# EAGLE design 5V-3.3V Regulators (Pre-prototype V2) (EAGLE 7.6.0)
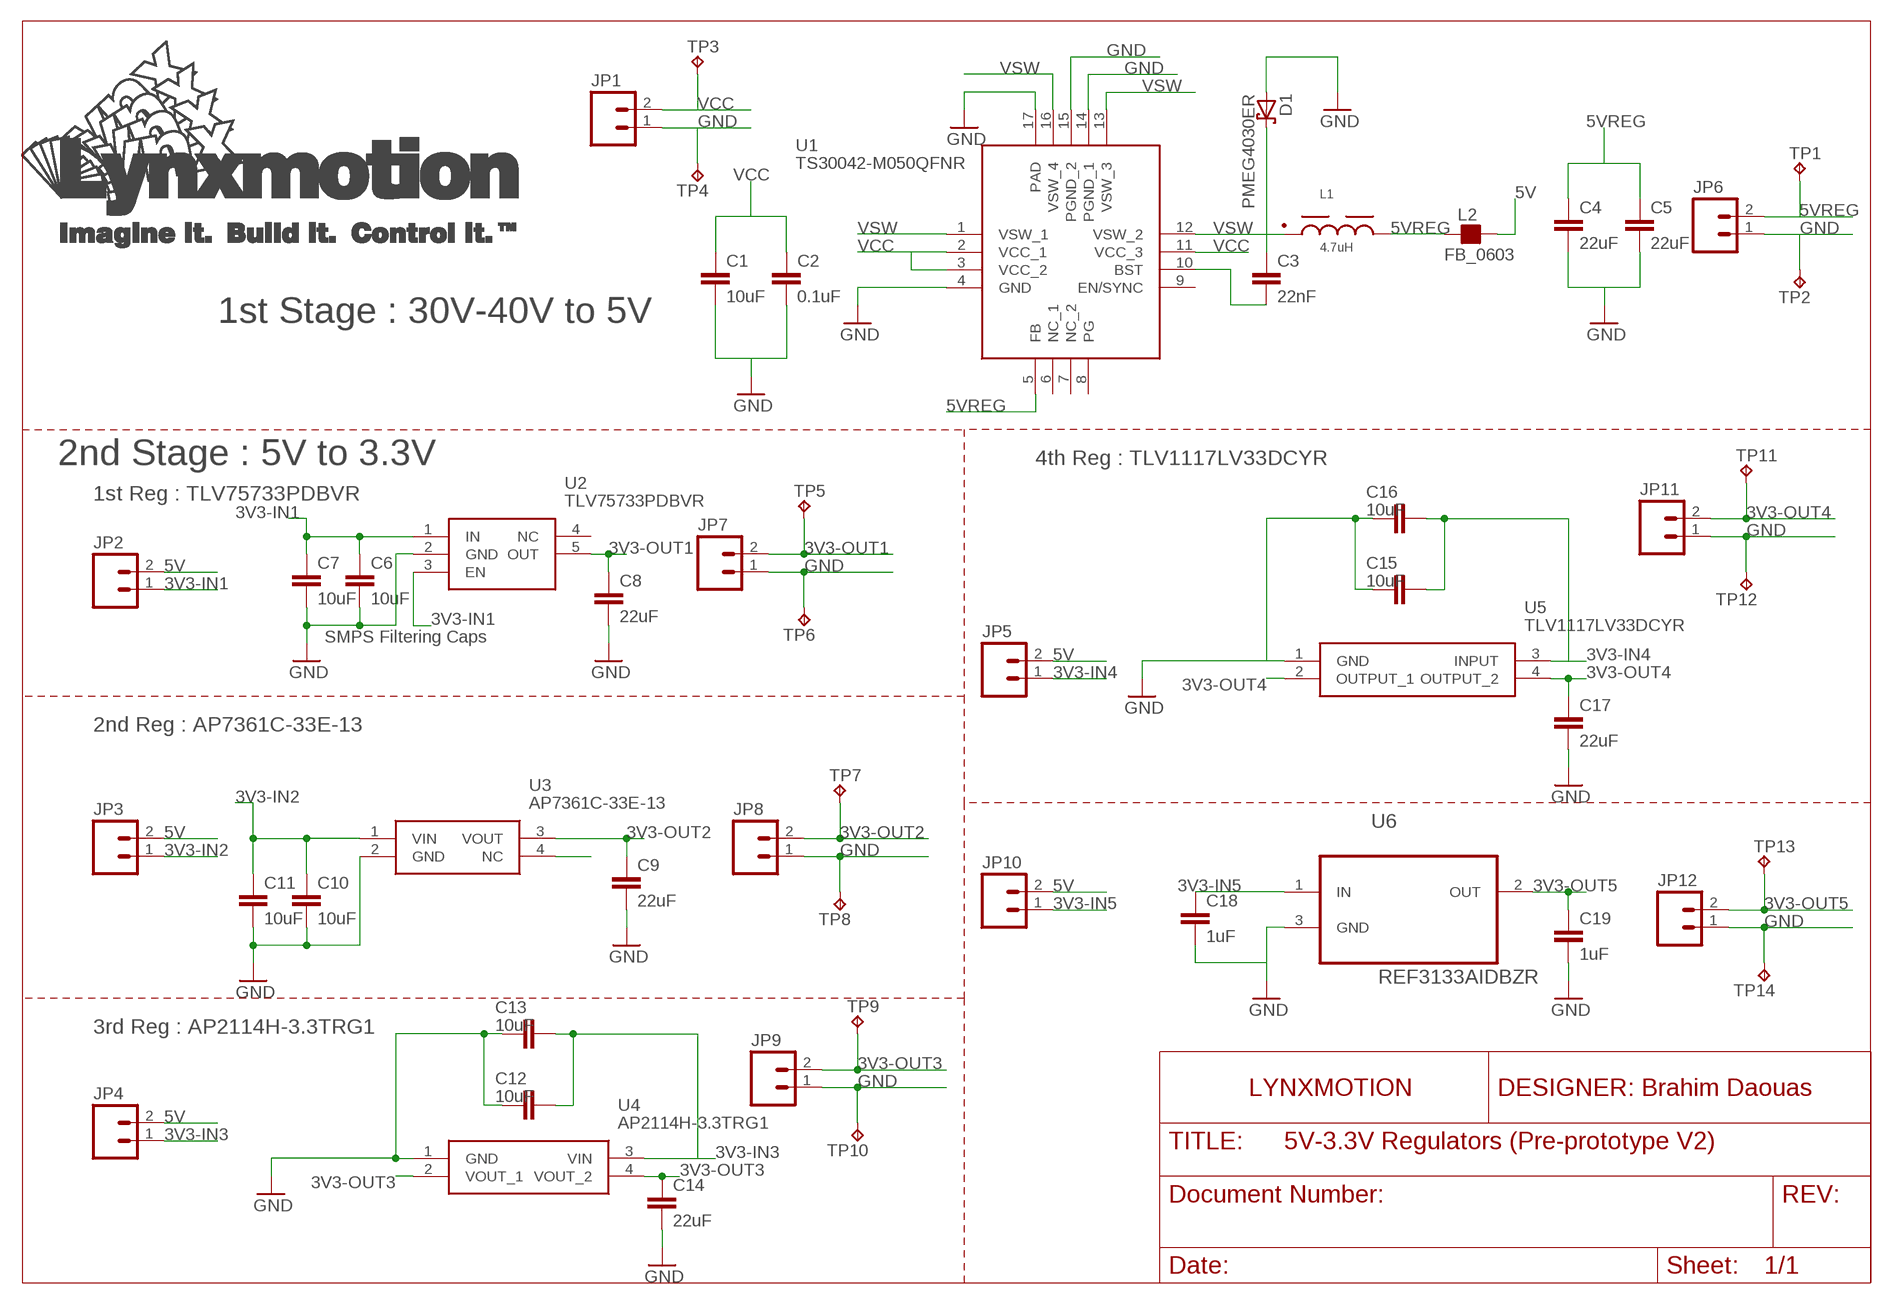
[diagram p0: schematic, sheet 1]

## Parts
C1  10uF  CAP1206  [1206]
C2  0.1uF  CAP0603-CAP  [0603-CAP]
C3  22nF  CAP0402-CAP  [0402-CAP]
C4  22uF  CAP0805  [0805]
C5  22uF  CAP0805  [0805]
C6  10uF  CAP0805  [0805]
C7  10uF  CAP0805  [0805]
C8  22uF  CAP0805  [0805]
C9  22uF  CAP0805  [0805]
C10  10uF  CAP0805  [0805]
C11  10uF  CAP0805  [0805]
C12  10uF  CAP0805  [0805]
C13  10uF  CAP0805  [0805]
C14  22uF  CAP0805  [0805]
C15  10uF  CAP0805  [0805]
C16  10uF  CAP0805  [0805]
C17  22uF  CAP0805  [0805]
C18  1uF  CAP0805  [0805]
C19  1uF  CAP0805  [0805]
D1  PMEG4030ER  [SOD123W]
JP1  M02PTH  [1X02]
JP2  M02PTH  [1X02]
JP3  M02PTH  [1X02]
JP4  M02PTH  [1X02]
JP5  M02PTH  [1X02]
JP6  M02PTH  [1X02]
JP7  M02PTH  [1X02]
JP8  M02PTH  [1X02]
JP9  M02PTH  [1X02]
JP10  M02PTH  [1X02]
JP11  M02PTH  [1X02]
JP12  M02PTH  [1X02]
L1  4.7uH  WE-PD2_5848_744774047  [WE-PD2_5848/5820]
L2  FB_0603  [L0603]
TP1  TP-040  [TP-040]
TP2  TP-040  [TP-040]
TP3  TP-040  [TP-040]
TP4  TP-040  [TP-040]
TP5  TP-040  [TP-040]
TP6  TP-040  [TP-040]
TP7  TP-040  [TP-040]
TP8  TP-040  [TP-040]
TP9  TP-040  [TP-040]
TP10  TP-040  [TP-040]
TP11  TP-040  [TP-040]
TP12  TP-040  [TP-040]
TP13  TP-040  [TP-040]
TP14  TP-040  [TP-040]
U1  TS30042-M050QFNR  [QFN16]
U2  TLV75733PDBVR  [SOT95P280X145-5N]
U3  AP7361C-33E-13  [SOT230P700X165-4N]
U4  AP2114H-3.3TRG1  [SOT230P700X180-4N]
U5  TLV1117LV33DCYR  [SOT230P700X180-4N]
U6  REF3133AIDBZR  [SOT95P237X112-3N]

## Nets
3V3-IN1: C6.1 C7.1 JP2.1 U2.1(IN) U2.3(EN)
3V3-IN2: C10.1 C11.1 JP3.1 U3.1(VIN)
3V3-IN3: C12.1 C13.1 JP4.1 U4.3(VIN)
3V3-IN4: C15.1 C16.1 JP5.1 U5.3(INPUT)
3V3-IN5: C18.1 JP10.1 U6.1(IN)
3V3-OUT1: C8.1 JP7.2 TP5.1 U2.5(OUT)
3V3-OUT2: C9.1 JP8.2 TP7.1 U3.3(VOUT)
3V3-OUT3: C14.1 JP9.2 TP9.1 U4.2(VOUT_1) U4.4(VOUT_2)
3V3-OUT4: C17.1 JP11.2 TP11.1 U5.2(OUTPUT_1) U5.4(OUTPUT_2)
3V3-OUT5: C19.1 JP12.2 TP13.1 U6.2(OUT)
5V: JP2.2 JP3.2 JP4.2 JP5.2 JP10.2 L2.2
5VREG: C4.1 C5.1 JP6.2 L1.2 L2.1 TP1.1 U1.5(FB)
GND: C1.2 C2.2 C4.2 C5.2 C6.2 C7.2 C8.2 C9.2 C10.2 C11.2 C12.2 C13.2 C14.2 C15.2 C16.2 C17.2 C18.2 C19.2 D1.2(A) JP1.1 JP6.1 JP7.1 JP8.1 JP9.1 JP11.1 JP12.1 TP2.1 TP4.1 TP6.1 TP8.1 TP10.1 TP12.1 TP14.1 U1.4(GND) U1.14(PGND_1) U1.15(PGND_2) U1.17(PAD) U2.2(GND) U3.2(GND) U4.1(GND) U5.1(GND) U6.3(GND)
N$4: U3.4(NC)
N$105: C3.2 U1.10(BST)
VCC: C1.1 C2.1 JP1.2 TP3.1 U1.2(VCC_1) U1.3(VCC_2) U1.11(VCC_3)
VSW: C3.1 D1.1(K) L1.1 U1.1(VSW_1) U1.12(VSW_2) U1.13(VSW_3) U1.16(VSW_4)
Unconnected: U1.6(NC_1) U1.7(NC_2) U1.8(PG) U1.9(EN/SYNC) U2.4(NC)

## Notes on the sheet
- 1st Stage : 30V-40V to 5V
- 2nd Stage : 5V to 3.3V | 4th Reg : TLV1117LV33DCYR
- 1st Reg : TLV75733PDBVR
- SMPS Filtering Caps
- 2nd Reg : AP7361C-33E-13
- 3rd Reg : AP2114H-3.3TRG1

## Library data of the parts
C1-C19 = SparkFun-Capacitors:CAP: Capacitor Standard 0603 ceramic capacitor, and 0.1" leaded capacitor.
D1 = nxp_60_1_1:PMEG4030E: 40 V, 3 A low VF MEGA Schottky barrier rectifier Planar Maximum Efficiency General Application (MEGA) Schottky barrier rectifier with an integrated guard ring for stress protection. AAL Eindhoven MK
JP1-JP12 = SparkFun-Connectors:M02: Standard 2-pin 0.1" header. Use with - straight break away headers ( PRT-00116) - right angle break away headers (PRT-00553) - swiss pins (PRT-00743) - machine pins (PRT-00117) - female headers (PRT-00115) Molex polarized connector foot print use with: PRT-08233 with associated crimp pins and housings. 2.54_SCREWTERM for use with PRT-10571. 3.5mm Screw Terminal footprints for PRT-08084 5mm Screw Terminal footprints for use with PRT-08432
L1 = EMCComponents (rev19b):WE-PD2_5848: SMD Power Inductor Characteristics Open size Saturation currents up to 14 A Low tolerances at high inductance values Operating temperature: –40 °C to +125 °C Applications Integrated DC/DC-converter Switching regulators with low operating voltages (Graphic cards, embedded PC-Cards, Mainboards) Optimal attenuation in MHz frequency range <http://katalog.we-online.de/media/images/v2/Family_WE-PD2.jpg> Details see: http://katalog.we-online.de/en/pbs/WE-PD2 Updated by Dan Xu 2014-07-08 2014 (C) Wurth Elektronik; WE-NUMBER: 744774047/4,7uH
L2 = rc-master-smd:FB_: FERRITE BEAD
TP1-TP14 = Test Points:TP: TEST POINT PCB Vertical Mount
U1 = LSS_Pro:TS30042-M050QFNR
U2 = TLV75733PDBVR:TLV75733PDBVR: LDO Voltage Regulators 1A Low-IQ Small-Size Low-Dropout (LDO) Regulator 5-SOT-23 -40 to 125 Source: Datasheet <http://www.ti.com/lit/gpn/TLV757P>; DESCRIPTION: LDO Voltage Regulators 1A Low-IQ Small-Size Low-Dropout (LDO) Regulator 5-SOT-23 -40 to 125; HEIGHT: 1.45mm; MANUFACTURER_NAME: Texas Instruments; MANUFACTURER_PART_NUMBER: TLV75733PDBVR; TEXAS_INSTRUMENTS_PART_NUMBER: TLV75733PDBVR; TEXAS_INSTRUMENTS_PRICE-STOCK: https://www.ti.com/store/ti/en/p/product/?p=TLV75733PDBVR
U3 = AP7361C-33E-13:AP7361C-33E-13: 1A LOW DROPOUT ADJUSTABLE AND FIXED-MODE REGULATOR WITH ENABLE Source: Datasheet <https://www.diodes.com/assets/Datasheets/AP7361C.pdf>; DESCRIPTION: 1A LOW DROPOUT ADJUSTABLE AND FIXED-MODE REGULATOR WITH ENABLE; HEIGHT: 1.65mm; MANUFACTURER_NAME: Diodes Inc.; MANUFACTURER_PART_NUMBER: AP7361C-33E-13
U4 = AP2114H-3.3TRG1:AP2114H-3.3TRG1: 1A 3.3V Low Noise LDO Regulator SOT223 DiodesZetex AP2114H-3.3TRG1, LDO Voltage Regulator, 1 (Min)A, 3.3 V +/-1.5%, 2.5 6 Vin, 3-Pin SOT-223 Source: Datasheet <http://uk.rs-online.com/web/p/products/8283528>; ALLIED_NUMBER: 70550988; ALLIED_PRICE-STOCK: https://www.alliedelec.com/diodes-inc-ap2114h-3-3trg1/70550988/; DESCRIPTION: 1A 3.3V Low Noise LDO Regulator SOT223 DiodesZetex AP2114H-3.3TRG1, LDO Voltage Regulator, 1 (Min)A, 3.3 V +/-1.5%, 2.5 6 Vin, 3-Pin SOT-223; HEIGHT: 1.8mm; MANUFACTURER_NAME: Diodes Inc.; MANUFACTURER_PART_NUMBER: AP2114H-3.3TRG1; MOUSER_PART_NUMBER: 621-AP2114H-3.3TRG1; MOUSER_PRICE-STOCK: https://www.mouser.com/Search/Refine.aspx?Keyword=621-AP2114H-3.3TRG1; RS_PART_NUMBER: 8283528; RS_PRICE-STOCK: https://uk.rs-online.com/web/p/products/8283528
U5 = TLV1117LV33DCYR:TLV1117LV33DCYR: 1-A, Positive Fixed Voltage, Low-Dropout Regulator Source: Datasheet <http://www.ti.com/lit/gpn/tlv1117lv>; DESCRIPTION: 1-A, Positive Fixed Voltage, Low-Dropout Regulator; HEIGHT: 1.8mm; MANUFACTURER_NAME: Texas Instruments; MANUFACTURER_PART_NUMBER: TLV1117LV33DCYR; MOUSER_PART_NUMBER: 595-TLV1117LV33DCYR; MOUSER_PRICE-STOCK: https://www.mouser.com/Search/Refine.aspx?Keyword=595-TLV1117LV33DCYR
U6 = REF3133AIDBZR:REF3133AIDBZR: SERIES VOLTAGE REFERENCE; AVAILABILITY: Unavailable; DESCRIPTION: 20ppm/°C Max, 100µA, SOT23-3 Series Voltage Reference 3-SOT-23 -40 to 125; MF: Texas Instruments; MP: REF3133AIDBZR; PACKAGE: SOT-23-3 Texas Instruments; PRICE: None

## Board
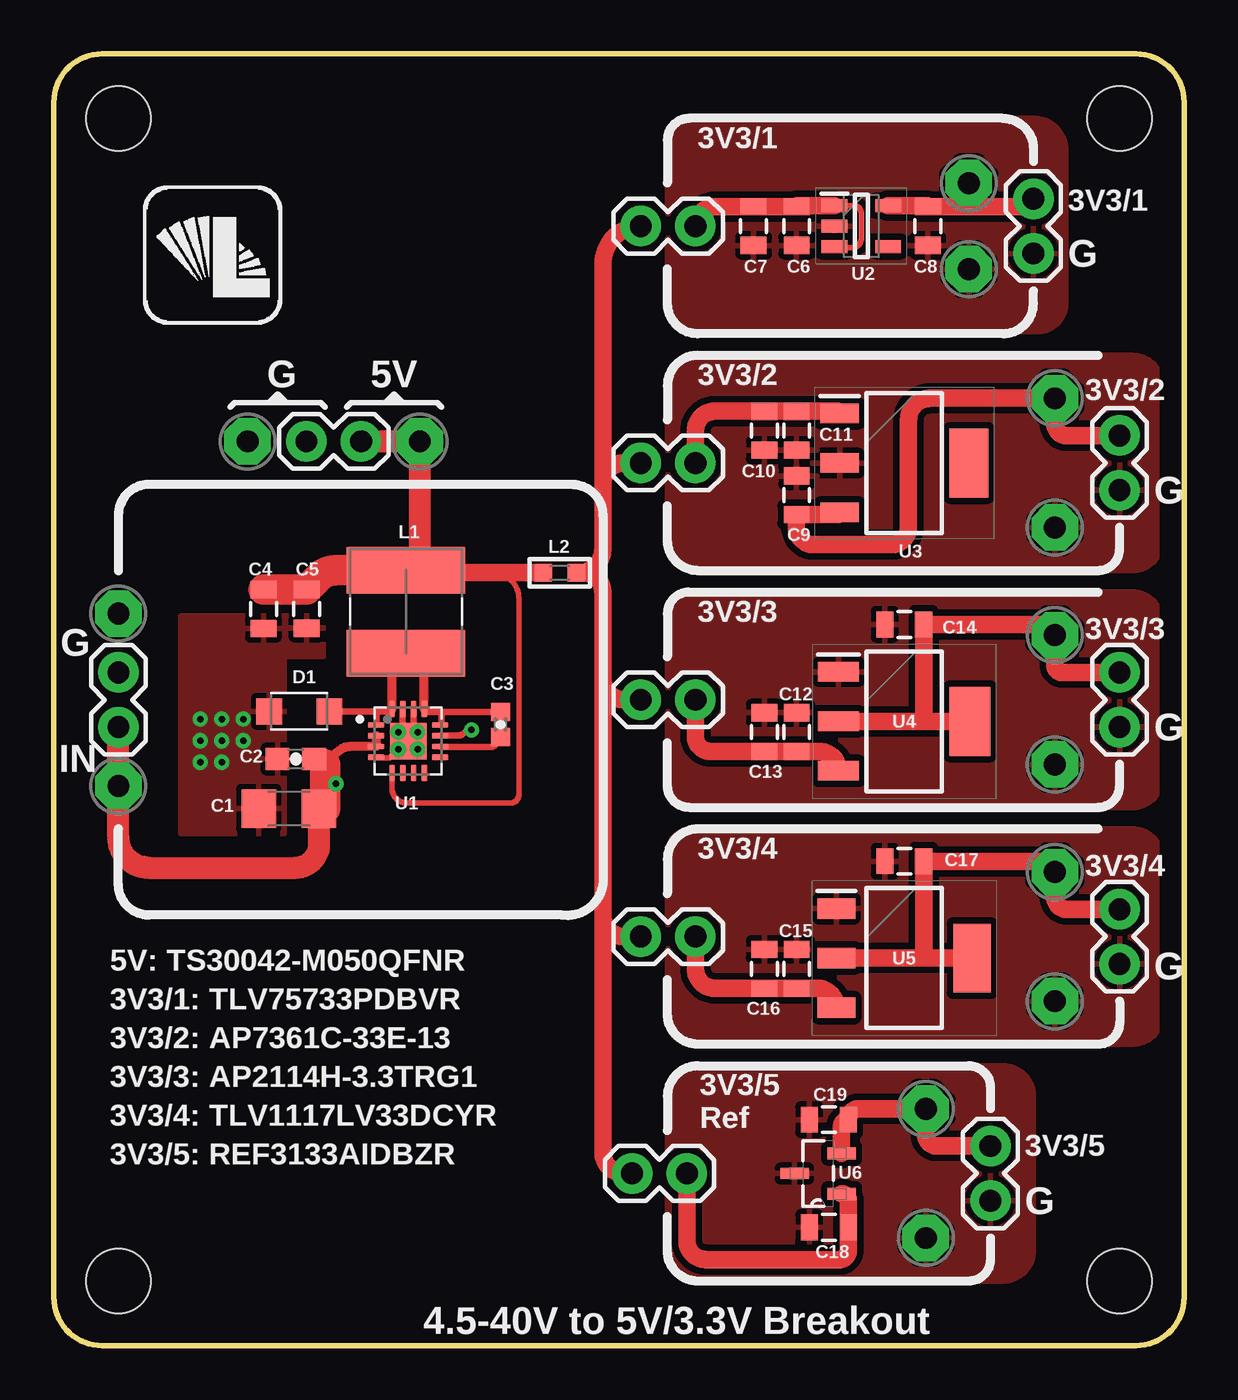
[diagram p1: board, top side]
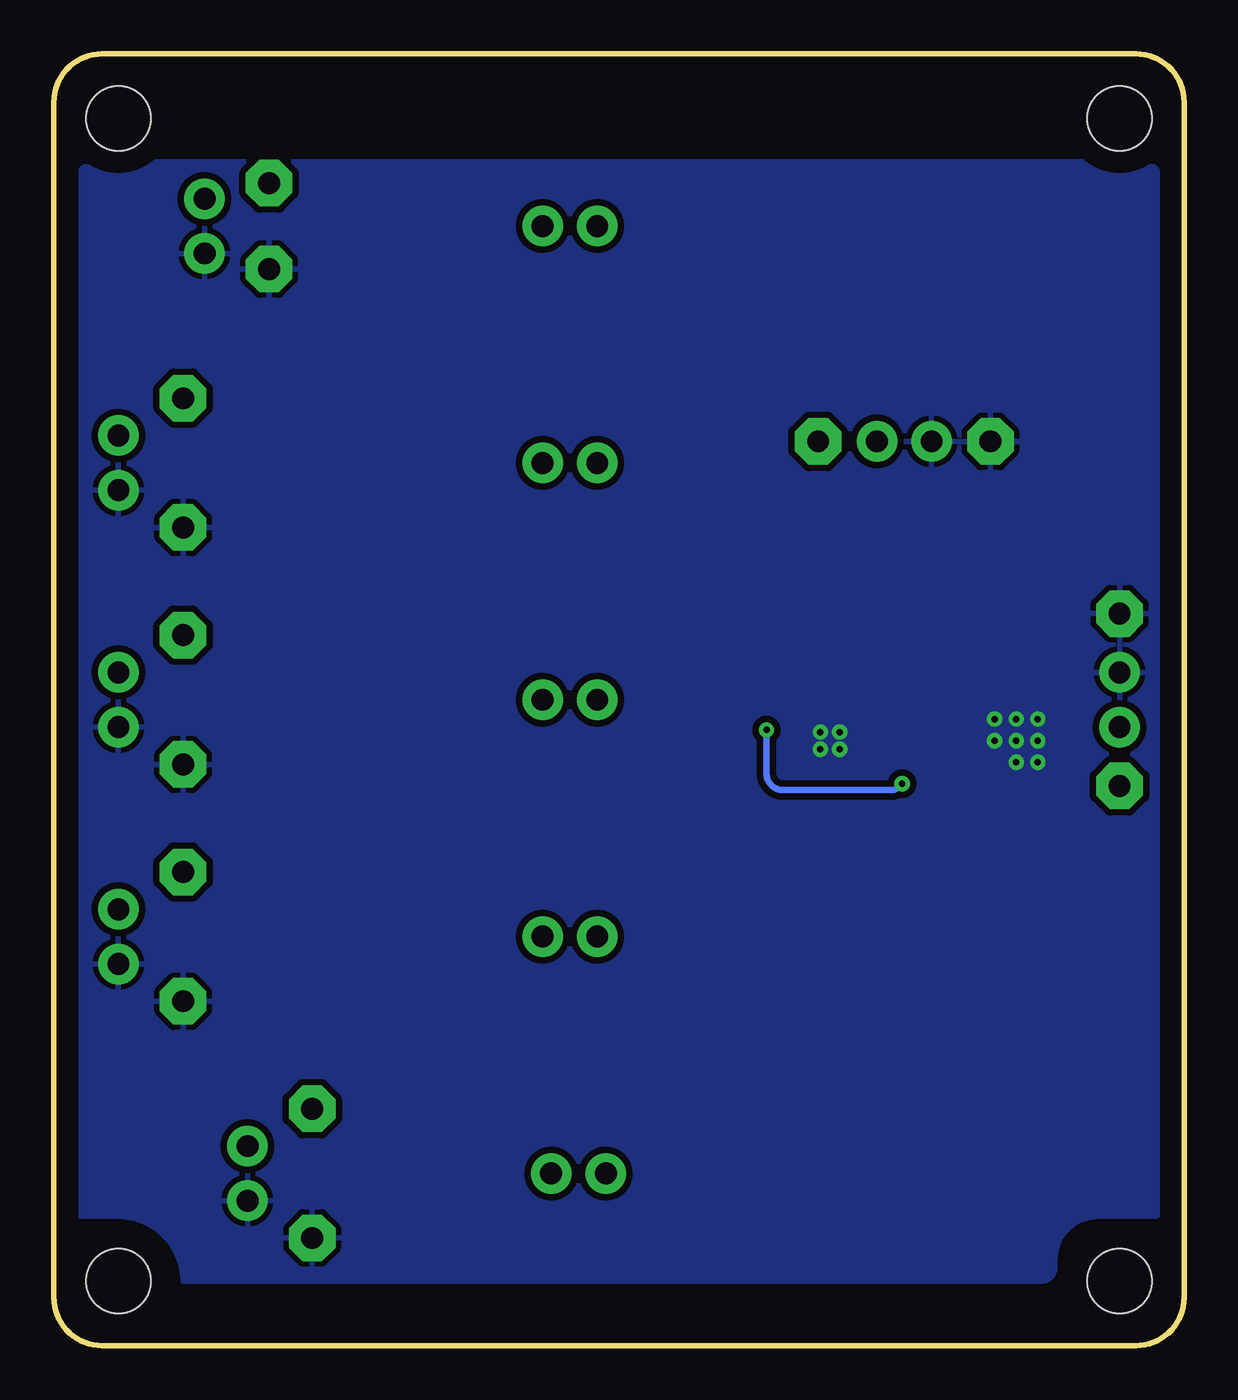
[diagram p2: board, bottom side, seen from below]

Size 52.5 x 60 mm. Coordinates in mm from the lower left corner, seen from the top.
Outline: 2.24,0 50.26,0 arc90 52.5,2.24 52.5,57.76 arc90 50.26,60 2.24,60 arc90 0,57.76 0,2.24 arc90 2.24,0
Copper layers (1*16): Top 0.035mm / dielectric 1.5mm / Bottom 0.035mm
Design rules "default *": minimum track width 10mil, minimum drill 0.3mm, track to track 8mil, track to pad 8mil, pad to pad 8mil, via to via 8mil, smd to smd 8mil, copper to edge 40mil, drill to drill 8mil, minimum pad ring 10mil, minimum via ring 8mil, stop-mask expansion 4mil, vias tented up to drill 25mil, thermal gap 10mil
Holes 3 mm at 3,57 49.5,57 3,3 49.5,3

### Footprints (pad centres in the part's own frame; a part is rotated, then mirrored left to right if it is on the bottom)
1206 = smd 1.6 x 1.8: 1 -1.4,0; 2 1.4,0
0603-CAP = smd 1.1 x 1: 1 -0.85,0; 2 0.85,0
0402-CAP = smd 0.85 x 0.9: 1 -0.58,0; 2 0.58,0
0805 = smd 0.8 x 1.2: 1 -0.9,0; 2 0.9,0
SOD123W = smd 1.2 x 1.2: 1 -1.4,0; 2 1.4,0
1X02 = drill 1.016 pad 1.88: 1 0,0; 2 2.54,0
WE-PD2_5848/5820 = smd 2.15 x 5.5: 1 -1.925,0; 2 1.925,0
L0603 = smd 0.8 x 0.8: 1 -0.762,0; 2 0.762,0
TP-040 = drill 1.016 pad 2.159 octagon: 1 0,0
QFN16 = smd 0.76 x 0.26: 1 -1.485,0.75; 2 -1.485,0.25; 3 -1.485,-0.25; 4 -1.485,-0.75; 9 1.485,-0.75; 10 1.485,-0.25; 11 1.485,0.25; 12 1.485,0.75 | smd 0.26 x 0.76: 5 -0.75,-1.485; 6 -0.25,-1.485; 7 0.25,-1.485; 8 0.75,-1.485; 13 0.75,1.485; 14 0.25,1.485; 15 -0.25,1.485; 16 -0.75,1.485 | smd 1.7 x 1.7: 17 0,0
SOT95P280X145-5N = smd 1.2 x 0.6: 1 -1.25,0.95; 2 -1.25,0; 3 -1.25,-0.95; 4 1.25,-0.95; 5 1.25,0.95
SOT230P700X165-4N = smd 1.8 x 0.9: 1 -3,2.3; 2 -3,0; 3 -3,-2.3 | smd 1.8 x 3.2: 4 3,0
SOT230P700X180-4N = smd 1.9 x 0.9: 1 -3.05,2.3; 2 -3.05,0; 3 -3.05,-2.3 | smd 1.9 x 3.2: 4 3.05,0
SOT230P700X180-4N' = smd 1.75 x 0.95: 1 -3.15,2.3; 2 -3.15,0; 3 -3.15,-2.3 | smd 1.75 x 3.2: 4 3.15,0
SOT95P237X112-3N = smd 1.321 x 0.559: 1 -1.092,0.94; 2 -1.092,-0.94 | smd 1.321 x 0.508: 3 1.092,0

### Placement (x,y rotation side)
C1  10.92,24.94 180 top
C2  11.24,27.25 180 top
C3  20.75,28.85 270 top
C4  9.74,34.21 270 top
C5  11.74,34.22 270 top
C6  34.5,52 270 top
C7  32.5,52 270 top
C8  40.6,52 270 top
C9  34.5,39.5 90 top
C10  33,42.5 270 top
C11  34.5,42.5 270 top
C12  34.5,28.5 90 top
C13  33,28.5 90 top
C14  39.5,33.5 180 top
C15  34.5,17.5 90 top
C16  33,17.5 90 top
C17  39.5,22.5 180 top
C18  36,5.5 180 top
C19  36,10.5 180 top
D1  11.4,29.46 180 top
JP1  3,31.27 270 top
JP2  29.8,52 180 top
JP3  29.8,41 180 top
JP4  29.8,30 180 top
JP5  29.8,19 180 top
JP6  11.73,42 0 top
JP7  45.5,50.73 90 top
JP8  49.5,39.73 90 top
JP9  49.5,28.73 90 top
JP10  29.4,8 180 top
JP11  49.5,17.73 90 top
JP12  43.5,6.73 90 top
L1  16.36,34.09 90 top
L2  23.5,35.9 0 top
TP1  17,42 0 top
TP2  9,42 0 top
TP3  3,26 0 top
TP4  3,34 0 top
TP5  42.5,54 0 top
TP6  42.5,50 0 top
TP7  46.5,44 0 top
TP8  46.5,38 0 top
TP9  46.5,33 0 top
TP10  46.5,27 0 top
TP11  46.5,22 0 top
TP12  46.5,16 0 top
TP13  40.5,11 0 top
TP14  40.5,5 0 top
U1  16.46,28.08 0 top
U2  37.5,52 0 top
U3  39.5,41 0 top
U4  39.5,29 0 top
U5  TLV1117LV33DCYR  [SOT230P700X180-4N']  39.5,18 0 top
U6  35.5,8 180 top

### Tracks (layer width: path | path; a pad name or v marks a point on that pad's centre or on a via)
3V3-IN1
  Top 0.254: U2.1 37.15,52.95 arc-90 37.5,52.6 37.5,51.4 arc-90 37.1,51 36.3,51 arc-90 U2.3
  Top 0.813: U2.1 34.55,52.95 arc90 C6.1 C7.1 30.7,52.9 arc90 JP2.1
3V3-IN2
  Top 0.813: JP3.1 29.8,42.5 arc-90 30.7,43.4 C10.1 C11.1 36.4,43.4 arc-90 U3.1
3V3-IN3
  Top 0.813: JP4.1 29.8,28.3 arc90 30.5,27.6 C13.1 C12.1 35.55,27.6 arc-90 U4.3
3V3-IN4
  Top 0.813: JP5.1 29.8,17.5 arc90 30.7,16.6 C16.1 C15.1 35.45,16.6 arc-90 U5.3
3V3-IN5
  Top 0.813: JP10.1 29.4,4.9 arc90 30.3,4 36.5,4 arc90 36.9,4.4 C18.1 36.9,6.75 arc90 U6.1
3V3-OUT1
  Top 0.813: U2.5 40.55,52.95 arc-90 C8.1 41.5,52.9 | 41.5,52.9 45.13,52.9 arc90 JP7.2 | TP5.1 42.5,53.9 arc-90 41.5,52.9
3V3-OUT2
  Top 0.813: U3.3 arc-90 36.4,38.6 C9.1 34.5,38 arc90 35.3,37.2 38.9,37.2 arc90 39.7,38 39.7,43 arc-90 40.7,44 TP7.1 46.5,42.8 arc90 47.03,42.27 JP8.2
3V3-OUT3
  Top 0.813: U4.2 40.2,29 | 40.2,29 U4.4 | 40.2,29 arc90 40.4,29.2 C14.1 46,33.5 arc-90 TP9.1 46.5,31.6 arc90 46.83,31.27 JP9.2
3V3-OUT4
  Top 0.813: U5.2 40.6,18 | 40.6,18 U5.4 | 40.6,18 arc-90 40.4,18.2 C17.1 46,22.5 arc-90 TP11.1 46.5,20.8 arc90 47.03,20.27 JP11.2
3V3-OUT5
  Top 0.813: U6.2 36.59,10.19 arc-90 C19.1 arc-90 37.4,11 TP13.1 40.5,9.8 arc90 41.03,9.27 JP12.2
5V
  Top 0.813: 25.5,40 25.5,37 arc-90 24.4,35.9 L2.2 24.6,35.9 arc-90 25.5,35 25.5,31 | 25.5,40 25.5,50.24 arc-90 JP2.2 | JP3.2 26.5,41 arc90 25.5,40 | 25.5,31 arc90 26.5,30 JP4.2 | 25.5,20 arc90 26.5,19 JP5.2 | 25.5,20 25.5,31 | JP10.2 26.5,8 arc-90 25.5,9 25.5,20
5VREG
  Top 0.254: U1.5 15.71,25.89 arc90 16.4,25.2 21.2,25.2 arc90 21.6,25.6 21.6,34.7 arc90 20.4,35.9 | 16.9,36 16.38,36
  Top 0.813: L2.1 20.4,35.9 16.48,35.9 arc-90 L1.2
  Top 1.016: 16.9,36 arc90 17,36.1 TP1.1 JP6.2
  Top 1.422: C4.1 C5.1 12.29,35.67 arc-45 13.12,36.02 L1.2 arc-90 16.38,36
GND  (via drill 0.3)
  Top 0.254: U1.4 15.01,27.3 15.6,27.3 v16,27.7 16.08,27.7 arc90 U1.17 | v16.9,27.7 16.84,27.7 U1.17 | v16.9,28.5 16.88,28.5 arc90 U1.17
  Top 0.305: U1.15 16.21,28.71 v16,28.5 | U1.14 16.71,28.69 v16.9,28.5
  other vias: 6.8,29.1 7.8,29.1 8.8,29.1 8.8,28.1 7.8,28.1 6.8,28.1 6.8,27.1 7.8,27.1
  pour Top: 12.5,33.9 12.5,32 10.7,32 10.7,23.8 5.9,23.8 5.9,33.9
  pour Bottom (isolate 0.3): 4,6 1.45,6 arc-90 1,6.45 1,53.87 arc-90 2.13,55 50.37,55 arc-90 51.5,53.87 51.5,6.2 arc-90 51.3,6 49.5,6 arc90 46.5,3 6.63,3 arc-90 6,3.63 6,4 arc90
  pour Top (isolate 0.3): 29.5,57 45.59,57 arc-90 47,55.49 47,48.31 arc-90 45.59,47.1 29.91,47 arc-90 28.5,48.41 28.5,56 arc-90
  pour Top (isolate 0.3): 29.78,46 50.09,46 arc-90 51.5,44.59 51.5,37.41 arc-90 50.09,36 29.78,36 arc-90 28.5,37.28 28.5,44.72 arc-90
  pour Top (isolate 0.3): 29.39,35 50.09,35 arc-90 51.5,33.59 51.5,26.41 arc-90 50.09,25 29.5,25 arc-90 28.5,26 28.5,34.11 arc-90
  pour Top (isolate 0.3): 29.63,24 50.09,24 arc-90 51.5,22.59 51.5,15.41 arc-90 50.09,14 29.67,14 arc-90 28.5,15.17 28.5,22.87 arc-90
  pour Top (isolate 0.3): 29.94,13 44.09,13 arc-90 45.5,11.59 45.5,4.41 arc-90 44.09,3 29.91,3 arc-90 28.5,4.41 28.5,11.56 arc-90
N$105
  Top 0.305: C3.2 20.75,28.15 20.51,27.91 arc-45 20.25,27.8 17.98,27.8 U1.10
VCC  (via drill 0.3)
  Top 0.305: v19.4,28.6 19.32,28.6 arc45 19.12,28.52 19.05,28.45 arc-45 18.75,28.33 U1.11 | v13.1,26.1 12.6,26.1
  Top 0.406: U1.2 U1.3 13.81,27.83 arc45 13.16,27.56 12.6,27 12.34,27 C2.1
  Top 1.016: C1.1 12.32,23.3 arc-90 11.22,22.2 4.4,22.2 arc-90 3,23.6 TP3.1 JP1.2
  Top 1.422: C1.1 12.6,24.94 12.6,26.1 12.6,27
  Bottom 0.305: v19.4,28.6 19.4,26.58 arc-90 18.62,25.8 13.63,25.8 arc-45 13.23,25.97 v13.1,26.1
VSW
  Top 0.305: D1.1 15,29.46 | 15,29.46 15.71,29.46 U1.16 | U1.1 15,28.83 15,29.46 | C3.1 18,29.43 | 18,29.43 17.34,29.43 U1.13 | U1.12 18,28.83 18,29.43
  Top 0.406: 15.6,31.41 L1.1 | U1.13 17.2,32 16.52,32 L1.1 | U1.16 15.71,31.52 L1.1

### Text on the board
tPlace: 3V3/1 | 3V3/1 | G | 3V3/2 | G | 5V | 3V3/2 | G | 3V3/3 | G | 3V3/3 | IN | G | 3V3/4 | 3V3/4 | 5V: TS30042-M050QFNR | G | 3V3/1: TLV75733PDBVR | 3V3/2: AP7361C-33E-13 | 3V3/3: AP2114H-3.3TRG1 | 3V3/4: TLV1117LV33DCYR | 3V3/5 / Ref | 3V3/5 | 3V3/5: REF3133AIDBZR | G | 4.5-40V to 5V/3.3V Breakout